# Altium schematic sheet fmc_digital_io_ipmi.SchDoc: EEPROM &
size 420 x 297 mm; EDA_Number: EDA-02064-V1-0; Projet: FmcDIO16chTTLa; CheckedBy: MK; Author: G.K.; CompanyName: CREOTECH; DrawnBy: G.K.; Organization: CTI SA; Address1: Creotech Instruments SA; Address2: Okulickiego 7/9, 05-500 Poland; DocumentNumber: 28; Revision: -; SheetNumber: 28; SheetTotal: 29; ModifiedBy: -; CreateDate: XX/XX/XXXX; CheckedDate: -; Title2: Thermometer; DivGrp: CTI; Designer: G.K.; ModifiedDate: -; ProjectName: FMC LVDS 32
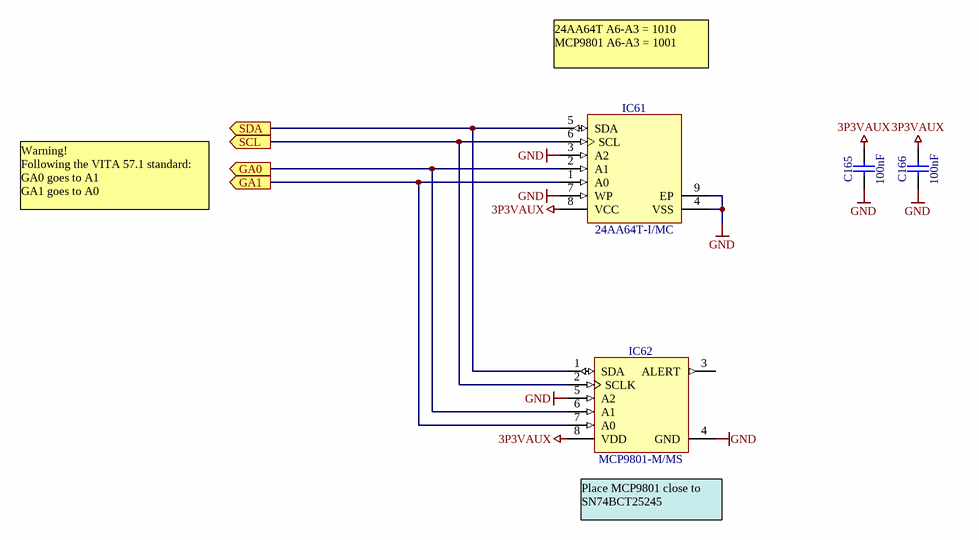
[diagram p0: fmc_digital_io_ipmi.SchDoc]

## Parts
C165  100nF  [CAPC1005X55N]
C166  100nF  [CAPC1005X55N]
IC61  24AA64T-I/MC  [SON50P300X200X100-9N-S175X155]
IC62  MCP9801-M/MS  [SOP65P490X110-8N]

## Ports
GA0 (out), GA1 (out), SCL (out), SDA (out)

## Nets
3P3VAUX: C165.2 C166.2 IC61.8(VCC) IC62.8(VDD)
GND: C165.1 C166.1 IC61.3(A2) IC61.4(VSS) IC61.7(WP) IC61.9(EP) IC62.4(GND) IC62.5(A2)
GA0: IC61.2(A1) IC62.6(A1) ; port GA0
GA1: IC61.1(A0) IC62.7(A0) ; port GA1
SCL: IC61.6(SCL) IC62.2(SCLK) ; port SCL
SDA: IC61.5(SDA) IC62.1(SDA) ; port SDA

Not connected (* = marked no-connect by the designer): IC62 3(ALERT)

## Notes on the sheet
- 24AA64T A6-A3 = 1010
  MCP9801 A6-A3 = 1001
- Warning!
  Following the VITA 57.1 standard:
  GA0 goes to A1
  GA1 goes to A0
- (near IC62) Place MCP9801 close to SN74BCT25245
- Project/Equipment
- Document
- Designer
- Drawn by
- Check.by
- Copyright Creotech Instruments SA 2014.
  This documentation describes Open Hardware and is licensed under the CERN OHL v.1.1. You may redistribute and modify this documentation under the terms of the CERN OHL v.1.1. (http://ohwr.org/CERNOHL). This documentation is distributed WITHOUT ANY EXPRESS OR IMPLIED WARRANTY, INCLUDING OF MERCHANTABILITY, SATISFACTORY QUALITY AND FITNESS FOR A PARTICULAR PURPOSE. Please see the CERN OHL v.1.1 for applicable conditions.
- File
- Last Mod.
- Print Date
- Sheet
- Size
- A3
- of
- Rev

## Library data of the parts
C165 C166 = CC0402_100NF_16V_10%_X5R: Non-polarised capacitor; Part Description: SMD Multilayer Chip Ceramic Capacitor; Manufacturer: GENERIC; Manufacturer1 Part Number: GRM155R61C104KA88D; Voltage: 16V; TC: X5R; Tolerance: ±10%; Table: Capacitors SMD; Part Number: CC0402_100NF_16V_10%_X5R; Component Kind: Standard; Component Type: Standard; Pin Count: 2; Value: 100nF; Status: None; Manufacturer Part Number: CC0402_100NF_16V_10%_X5R; Case: 0402; Mounted: Yes; Socket: No; SMD: Yes; Manufacturer1 Example: MURATA; Manufacturer1 ComponentHeight: 0.55mm; HelpURL: \\cern.ch\dfs\Applications\Altium\Datasheets\CC0402_X5R_MURATA_GRM.pdf; Author: CERN DEM JLC; CreateDate: 2013-12-10; LatestRevisionDate: 2013-12-10
IC61 = 24AA64T-I/MC: 1.7-5.5V 64K I2C Serial EEPROM; Manufacturer: MICROCHIP TECHNOLOGY; Table: Logic; Part Number: 24AA64T-I/MC; Component Kind: Standard; Component Type: Standard; Designator: 24AA64T-I/MC; Device: 24AA64T-I/MC; PackageDescription: SON (DFN), 0.50mm pitch, 8 pin, 2mm X 3mm X 1.00mm H body (w/thermal tab 1.75 X 1.55mm),  IPC Medium Density; Part Description: 64K I2C Serial EEPROM; Manufacturer Part Number: 24AA64T-I/MC; Pin Count: 9; Case: DFN8; Mounted: Yes; Socket: No; SMD: Yes; ComponentHeight: 1.0mm; Datasheet: \\cern.ch\dfs\Applications\Altium\Datasheets\24AA64T-I-MC.pdf; HelpURL: \\cern.ch\dfs\Applications\Altium\Datasheets\24AA64T-I-MC.pdf; Author: CERN DEM JLC; CreateDate: 11/18/2009; LatestRevisionDate: 11/18/2009
IC62 = MCP9801-M/MS: 2-Wire High-Accuracy Temperature Sensor; Manufacturer: MICROCHIP TECHNOLOGIY; Table: Sensors; Part Number: MCP9801-M/MS; Component Kind: Standard; Component Type: Standard; Designator: MCP9801-M/MS; Device: MCP9801-M/MS; PackageDescription: SOP, 0.65mm pitch; 8 pin, 3.00mm W X 3.00mm L X 1.10mm H body, IPC Medium Density; Part Description: 2-Wire High-Accuracy Temperature Sensor; Manufacturer Part Number: MCP9801-M/MS; Pin Count: 8; Case: MSOP8; Mounted: Yes; Socket: No; SMD: Yes; ComponentHeight: 1.1mm; Datasheet: \\cern.ch\dfs\Applications\Altium\Datasheets\MCP9801-M-MS.pdf; HelpURL: \\cern.ch\dfs\Applications\Altium\Datasheets\MCP9801-M-MS.pdf; Author: CERN DEM JLC; CreateDate: 11/18/2009; LatestRevisionDate: 11/18/2009